# EAGLE design S3 IMU LED rev 1.1 (EAGLE 9.7.0)
Assembly variants: ESP32-S3 IMU, Analog LED Only
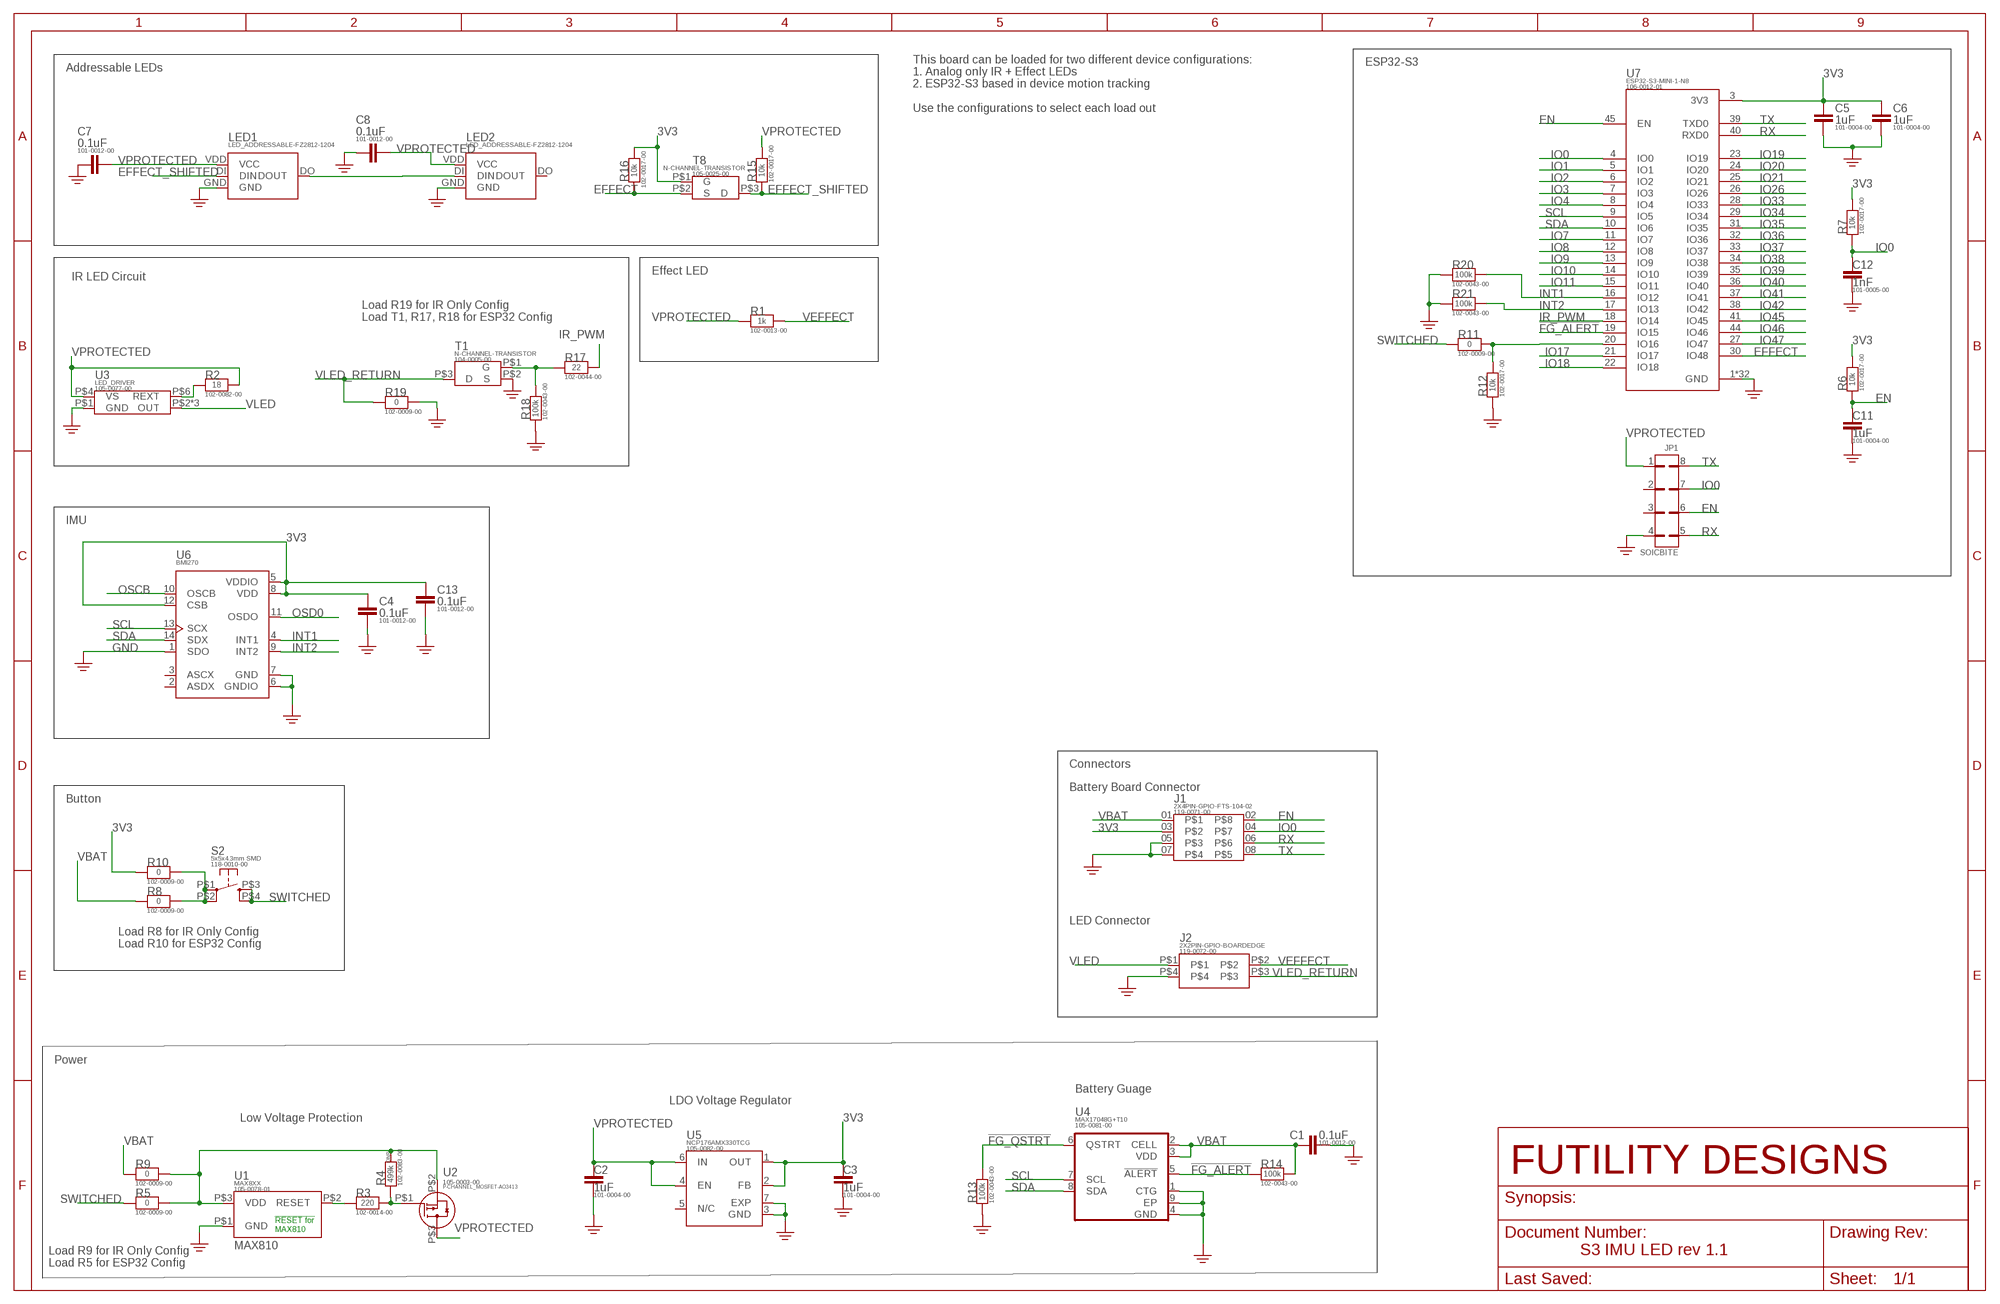
[diagram p0: schematic, sheet 1]

## Parts
C1  0.1uF  CAPACITOR-SMD-0402  [0402]  (not fitted in variant Analog LED Only)
C2  1uF  CAPACITOR-SMD-0402  [0402]  (not fitted in variant Analog LED Only)
C3  1uF  CAPACITOR-SMD-0402  [0402]  (not fitted in variant Analog LED Only)
C4  0.1uF  CAPACITOR-SMD-0402  [0402]  (not fitted in variant Analog LED Only)
C5  1uF  CAPACITOR-SMD-0402  [0402]  (not fitted in variant Analog LED Only)
C6  1uF  CAPACITOR-SMD-0402  [0402]  (not fitted in variant Analog LED Only)
C7  0.1uF  CAPACITOR-SMD-0402  [0402]  (not fitted in variant Analog LED Only)
C8  0.1uF  CAPACITOR-SMD-0402  [0402]  (not fitted in variant Analog LED Only)
C11  1uF  CAPACITOR-SMD-0402  [0402]  (not fitted in variant Analog LED Only)
C12  1nF  CAPACITOR-SMD-0402  [0402]  (not fitted in variant Analog LED Only)
C13  0.1uF  CAPACITOR-SMD-0402  [0402]  (not fitted in variant Analog LED Only)
J1  2X4PIN-GPIO-FTS-104-02  [SAMTEC_FTS-104-X-X-DV-X]
J2  2X2PIN-GPIO-BOARDEDGE  [LPPB022CFFN-BOARDEDGE]
JP1  SOICBITE  [SOICBITE]
LED1  LED_ADDRESSABLE-FZ2812-1204  [FZ2812-1204]  (not fitted in variant Analog LED Only)
LED2  LED_ADDRESSABLE-FZ2812-1204  [FZ2812-1204]  (not fitted in variant Analog LED Only)
R1  1k  RESISTOR-SMD0402  [0402]  (not fitted in variant ESP32-S3 IMU)
R2  18  RESISTOR-SMD0402  [0402]
R3  220  RESISTOR-SMD0402  [0402]
R4  499k  RESISTOR-SMD0402  [0402]
R5  0  RESISTOR-SMD0402  [0402]  (not fitted in variant Analog LED Only)
R6  10k  RESISTOR-SMD0402  [0402]  (not fitted in variant Analog LED Only)
R7  10k  RESISTOR-SMD0402  [0402]  (not fitted in variant Analog LED Only)
R8  0  RESISTOR-SMD0402  [0402]  (not fitted in variant ESP32-S3 IMU)
R9  0  RESISTOR-SMD0402  [0402]  (not fitted in variant ESP32-S3 IMU)
R10  0  RESISTOR-SMD0402  [0402]  (not fitted in variant Analog LED Only)
R11  0  RESISTOR-SMD0402  [0402]  (not fitted in variant Analog LED Only)
R12  10k  RESISTOR-SMD0402  [0402]  (not fitted in variant Analog LED Only)
R13  100k  RESISTOR-SMD0402  [0402]  (not fitted in variant Analog LED Only)
R14  100k  RESISTOR-SMD0402  [0402]  (not fitted in variant Analog LED Only)
R15  10k  RESISTOR-SMD0402  [0402]  (not fitted in variant Analog LED Only)
R16  10k  RESISTOR-SMD0402  [0402]  (not fitted in variant Analog LED Only)
R17  22  RESISTOR-SMD0402  [0402]  (not fitted in variant Analog LED Only)
R18  100k  RESISTOR-SMD0402  [0402]  (not fitted in variant Analog LED Only)
R19  0  RESISTOR-SMD0402  [0402]  (not fitted in variant ESP32-S3 IMU)
R20  100k  RESISTOR-SMD0402  [0402]  (not fitted in variant Analog LED Only)
R21  100k  RESISTOR-SMD0402  [0402]  (not fitted in variant Analog LED Only)
S2  5x5x4.3mm SMD  BUTTON_MOM-6X6X4.3SMD  [6X6X4.3_SMD]
T1  N-CHANNEL-TRANSISTOR  [SOT23]  (not fitted in variant Analog LED Only)
T8  N-CHANNEL-TRANSISTOR  [SOT23]  (not fitted in variant Analog LED Only)
U1  MAX8XX  [SOT23]
U2  P-CHANNEL_MOSFET-AO3413  [SOT23]
U3  LED_DRIVER  [SOT26]
U4  MAX17048G+T10  [SON50P200X200X80-9N]  (not fitted in variant Analog LED Only)
U5  NCP176AMX330TCG  [PSON40P120X120X45-7N_NCP176AMX330TCG]  (not fitted in variant Analog LED Only)
U6  BMI270  [XDCR_BMI270]  (not fitted in variant Analog LED Only)
U7  ESP32-S3-MINI-1-N8  [XCVR_ESP32-S3-MINI-1-N8]  (not fitted in variant Analog LED Only)

## Nets
3V3: C3.P$1 C4.P$1 C5.P$1 C6.P$1 C13.P$1 J1.03 R6.P$2 R7.P$2 R10.P$1 R16.P$2 T8.P$1(G) U5.1(OUT) U5.2(FB) U6.5(VDDIO) U6.8(VDD) U6.12(CSB) U7.3(3V3)
!FG_ALERT: R14.P$1 U4.5(!ALERT) U7.19(IO15)
!FG_QSTRT: R13.P$2 U4.6(QSTRT)
EFFECT: R16.P$1 T8.P$2(S) U7.30(IO48)
EFFECT_SHIFTED: LED1.DI(DIN) R15.P$1 T8.P$3(D)
EN: C11.P$1 J1.02 JP1.6 R6.P$1 U7.45(EN)
GND: C1.P$2 C2.P$2 C3.P$2 C4.P$2 C5.P$2 C6.P$2 C7.P$2 C8.P$2 C11.P$2 C12.P$2 C13.P$2 J1.05 J1.07 J2.P$4 JP1.4 LED1.GND LED2.GND R12.P$1 R13.P$1 R18.P$1 R19.P$2 R20.P$1 R21.P$1 T1.P$2(S) U1.P$1(GND) U3.P$1(GND) U4.1(CTG) U4.4(GND) U4.9(EP) U5.3(GND) U5.7(EXP) U6.1(SDO) U6.6(GNDIO) U6.7(GND) U7.1(GND) U7.2(GND) U7.42(GND) U7.43(GND) U7.46(GND) U7.47(GND) U7.48(GND) U7.49(GND) U7.50(GND) U7.51(GND) U7.52(GND) U7.53(GND) U7.54(GND) U7.55(GND) U7.56(GND) U7.57(GND) U7.58(GND) U7.59(GND) U7.60(GND) U7.61(GND) U7.61_1(GND) U7.61_2(GND) U7.61_3(GND) U7.61_4(GND) U7.61_5(GND) U7.61_6(GND) U7.61_7(GND) U7.61_8(GND) U7.62(GND) U7.63(GND) U7.64(GND) U7.65(GND)
INT1: R20.P$2 U6.4(INT1) U7.16(IO12)
INT2: R21.P$2 U6.9(INT2) U7.17(IO13)
IO0: C12.P$1 J1.04 JP1.7 R7.P$1 U7.4(IO0)
IO1: U7.5(IO1)
IO2: U7.6(IO2)
IO3: U7.7(IO3)
IO4: U7.8(IO4)
IO7: U7.11(IO7)
IO8: U7.12(IO8)
IO9: U7.13(IO9)
IO10: U7.14(IO10)
IO11: U7.15(IO11)
IO17: U7.21(IO17)
IO18: U7.22(IO18)
IO19: U7.23(IO19)
IO20: U7.24(IO20)
IO21: U7.25(IO21)
IO26: U7.26(IO26)
IO33: U7.28(IO33)
IO34: U7.29(IO34)
IO35: U7.31(IO35)
IO36: U7.32(IO36)
IO37: U7.33(IO37)
IO38: U7.34(IO38)
IO39: U7.35(IO39)
IO40: U7.36(IO40)
IO41: U7.37(IO41)
IO42: U7.38(IO42)
IO45: U7.41(IO45)
IO46: U7.44(IO46)
IO47: U7.27(IO47)
IR_PWM: R17.P$2 U7.18(IO14)
N$1: R4.P$2 R5.P$2 R9.P$2 U1.P$3(VDD) U2.P$2(S)
N$2: R2.P$1 U3.P$6(REXT)
N$3: R3.P$1 U1.P$2(RESET)
N$4: R3.P$2 R4.P$1 U2.P$1(G)
N$10: R8.P$2 R10.P$2 S2.P$1(P) S2.P$2(P1)
N$14: R17.P$1 R18.P$2 T1.P$1(G)
N$17: LED1.DO(DOUT) LED2.DI(DIN)
N$55: R11.P$2 R12.P$2 U7.20(IO16)
OSCB: U6.10(OSCB)
OSD0: U6.11(OSDO)
RX: J1.06 JP1.5 U7.40(RXD0)
SCL: U4.7(SCL) U6.13(SCX) U7.9(IO5)
SDA: U4.8(SDA) U6.14(SDX) U7.10(IO6)
SWITCHED: R5.P$1 R11.P$1 S2.P$3(S) S2.P$4(S1)
TX: J1.08 JP1.8 U7.39(TXD0)
VBAT: C1.P$1 J1.01 R8.P$1 R9.P$1 R14.P$2 U4.2(CELL) U4.3(VDD)
VEFFECT: J2.P$2 R1.P$2
VLED: J2.P$1 U3.P$2(OUT) U3.P$3(OUT) U3.P$5(OUT)
VLED_RETURN: J2.P$3 R19.P$1 T1.P$3(D)
VPROTECTED: C2.P$1 C7.P$1 C8.P$1 JP1.1 LED1.VDD(VCC) LED2.VDD(VCC) R1.P$1 R2.P$2 R15.P$2 U2.P$3(D) U3.P$4(VS) U5.4(EN) U5.6(IN)
Unconnected: JP1.2 JP1.3 LED2.DO(DOUT) U5.5(N/C) U6.2(ASDX) U6.3(ASCX)

## Notes on the sheet
- ESP32-S3
- Addressable LEDs
- This board can be loaded for two different device configurations:
  1. Analog only IR + Effect LEDs
  2. ESP32-S3 based in device motion tracking
  
  Use the configurations to select each load out
- Effect LED
- IR LED Circuit
- Load R19 for IR Only Config
  Load T1, R17, R18 for ESP32 Config
- IMU
- Connectors
- Battery Board Connector
- Button
- LED Connector
- Load R8 for IR Only Config
  Load R10 for ESP32 Config
- Power
- Battery Guage
- LDO Voltage Regulator
- Low Voltage Protection
- MAX810
- Load R9 for IR Only Config
  Load R5 for ESP32 Config

## Library data of the parts
C1 C4 C7 C8 C13 = 1-chris-parts:CAPACITOR-SMD; PART_NUMBER: 101-0012-00
C2 C3 C5 C6 C11 = 1-chris-parts:CAPACITOR-SMD; PART_NUMBER: 101-0004-00
C12 = 1-chris-parts:CAPACITOR-SMD; PART_NUMBER: 101-0005-00
J1 = 1-Chris-Connectors:2X4PIN-GPIO; PART_NUMBER: 119-0071-00
J2 = 1-Chris-Connectors:2X2PIN-GPIO; PART_NUMBER: 119-0072-00
JP1 = 1-chris-parts:SOICBITE: SOICbite footprint Allows for direct clipping of a SOIC-8 Testclip onto a PCB edge for Programming/Debugging purposes without extra components. Original footprint created by: Simon Merrit Adapted to Eagle by: Chiel Voswijk (Foxhood) NOTE: Footprint is to be used on the edge of a PCB and may require the use of thin traces for accessing the inner pads. This may violate some Design Rules! One can often ignore these, but understand working is NOT guaranteed.
LED1 LED2 = 1-chris-parts:LED_ADDRESSABLE; PART_NUMBER: 103-0018-00
R1 = 1-chris-parts:RESISTOR-SMD; PART_NUMBER: 102-0013-00
R2 = 1-chris-parts:RESISTOR-SMD; PART_NUMBER: 102-0082-00
R3 = 1-chris-parts:RESISTOR-SMD; PART_NUMBER: 102-0014-00
R4 = 1-chris-parts:RESISTOR-SMD; DNP: yes; PART_NUMBER: 102-0083-00
R5 R8-R11 R19 = 1-chris-parts:RESISTOR-SMD; PART_NUMBER: 102-0009-00
R6 R7 R12 R15 R16 = 1-chris-parts:RESISTOR-SMD; PART_NUMBER: 102-0017-00
R13 R14 R18 R20 R21 = 1-chris-parts:RESISTOR-SMD; PART_NUMBER: 102-0043-00
R17 = 1-chris-parts:RESISTOR-SMD; PART_NUMBER: 102-0044-00
S2 = 1-chris-parts:BUTTON_MOM: OMRON SWITCH; PART_NUMBER: 118-0010-00
T1 = 1-chris-parts:N-CHANNEL-TRANSISTOR; PART_NUMBER: 104-0005-00
T8 = 1-chris-parts:N-CHANNEL-TRANSISTOR; PART_NUMBER: 105-0025-00
U1 = 1-chris-parts:MAX8XX; PART_NUMBER: 105-0078-01
U2 = 1-chris-parts:P-CHANNEL_MOSFET; PART_NUMBER: 105-0003-00
U3 = 1-chris-parts:LED_DRIVER; PART_NUMBER: 105-0077-00
U4 = 1-chris-parts:MAX17048G+T10; PART_NUMBER: 105-0081-00
U5 = 1-chris-parts:NCP176AMX330TCG; PART_NUMBER: 105-0082-00
U6 = 1-chris-parts:BMI270; MANUFACTURER: Bosch Sensortec; PART_NUMBER: 109-0015-00
U7 = 1-Chris-ESP:ESP32-S3-MINI-1-N8; MANUFACTURER: Espressif; PART_NUMBER: 106-0012-01

## Net classes
1 diff pairs: width 0.152 mm

## Board
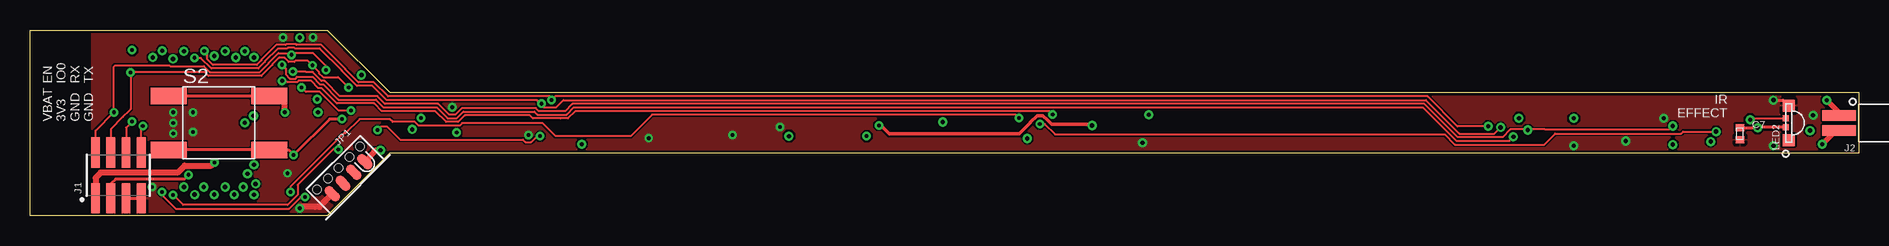
[diagram p1: board, top side]
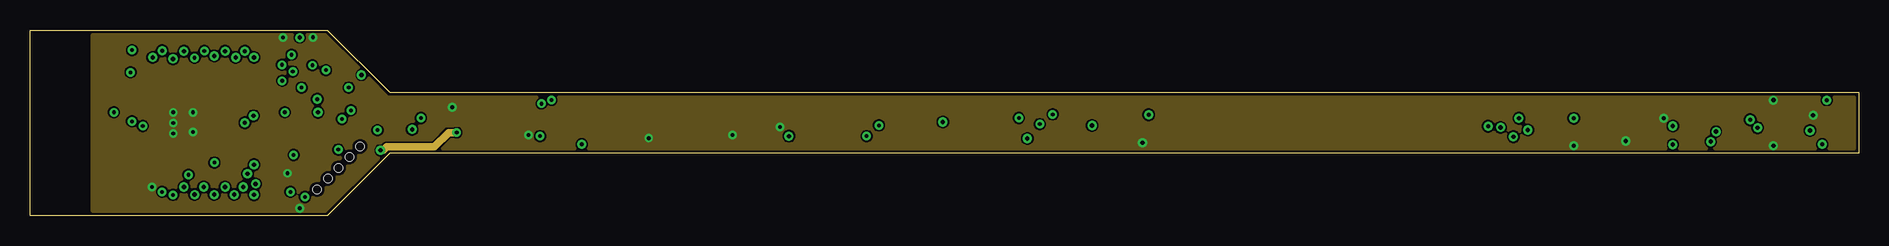
[diagram p2: board, inner layer Route2]
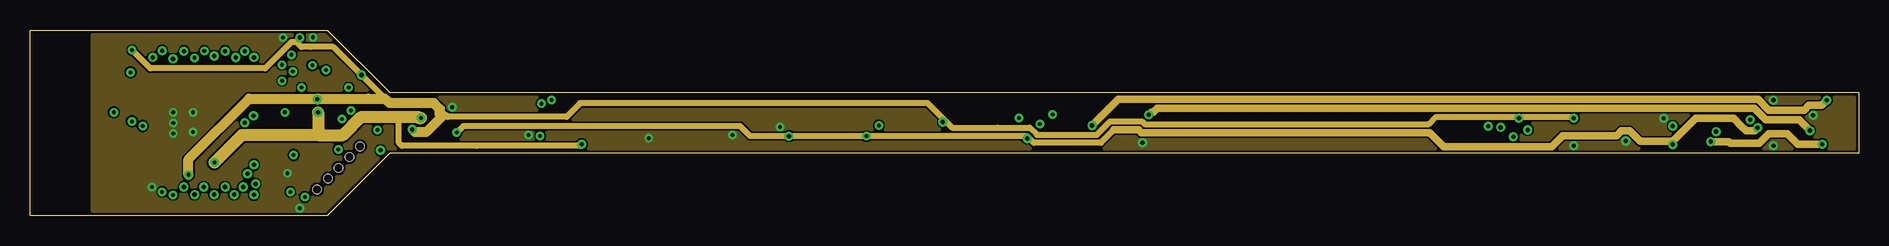
[diagram p3: board, inner layer Route63]
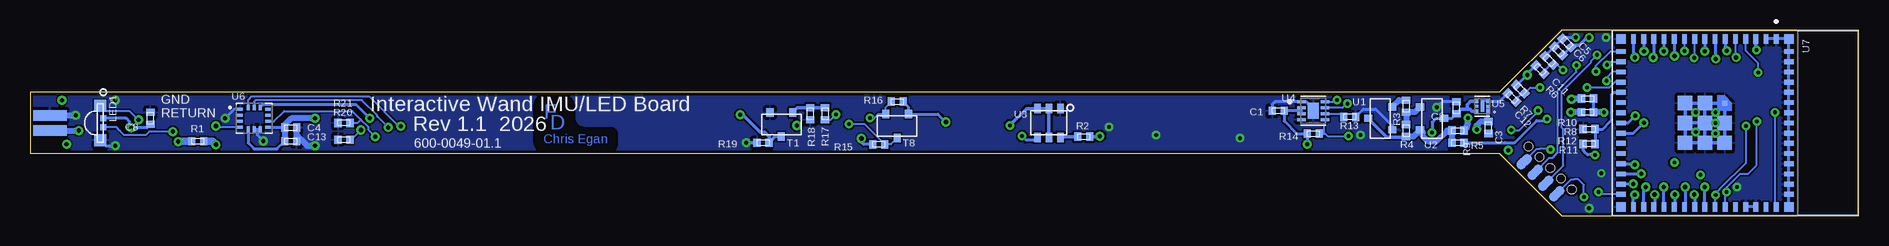
[diagram p4: board, bottom side, seen from below]

Size 152.4 x 15.49 mm. Coordinates in mm from the lower left corner, seen from the top.
Outline: 29.97,5.21 24.77,0 0,0 0,15.49 24.77,15.49 29.97,10.29 152.4,10.29 152.4,5.21 29.97,5.21
Copper layers (1+2*15+16): Top / Route2 / Route63 / Bottom
Stack-up 4 Layer Stack: Top SilkScreen Epoxy Ink / Top SolderMask SR:Green 0.0254mm Dk 4.3 / Top Surface Finish Lead-Free 0.02mm / Top CuFoil:007 0.035mm / Dielectric-1 Prepreg:001 0.064mm / Dielectric-2 Prepreg:001 0.064mm / Route2 CuFoil:007 0.035mm / Dielectric-3 User Defined 0.52mm / Route63 CuFoil:007 0.035mm / Dielectric-4 Prepreg:001 0.064mm / Dielectric-5 Prepreg:001 0.064mm / Bottom CuFoil:007 0.035mm / Bottom Surface Finish Lead-Free 0.02mm / Bottom SolderMask SR:Green 0.0254mm Dk 4.3 / Bottom SilkScreen Epoxy Ink
Design rules: minimum copper width classes=1 6mil, minimum copper width 6mil, minimum drill size 0.3mm, copper clearance wire_polygon to wire_polygon 6mil, copper clearance wire_polygon to pad_smd 6mil, copper clearance wire_polygon to via 6mil, copper clearance pad_smd to pad_smd 6mil, copper clearance pad_smd to via 6mil, copper clearance via to via 6mil, copper clearance smd to pad (same net) 6mil, copper clearance smd to via (same net) 6mil, copper clearance smd to smd (same net) 6mil, dimension clearance 10mil, via restrict clearance 0mil, restrict clearance 0mil, drill distance 6mil, keepout clearance 0mil

### Footprints (pad centres in the part's own frame; a part is rotated, then mirrored left to right if it is on the bottom)
0402 = smd 0.7 x 0.6: P$1 0,0.5; P$2 0,-0.5
SAMTEC_FTS-104-X-X-DV-X = smd 0.737 x 2.54: 01 -1.905,-1.905; 02 -1.905,1.905; 03 -0.635,-1.905; 04 -0.635,1.905; 05 0.635,-1.905; 06 0.635,1.905; 07 1.905,-1.905; 08 1.905,1.905
LPPB022CFFN-BOARDEDGE = smd 2.794 x 0.889: P$1 1.651,-0.635; P$2 1.651,0.635 | smd 2.794 x 0.889 bottom: P$3 1.651,0.635; P$4 1.651,-0.635
SOICBITE = smd 0.8 x 1.5: 1 1.905,0.75; 2 0.635,0.75; 3 -0.635,0.75; 4 -1.905,0.75 | smd 0.8 x 1.5 bottom: 5 -1.905,0.75; 6 -0.635,0.75; 7 0.635,0.75; 8 1.905,0.75 | hole 0.7: -2.54,1.905; -1.27,1.905; 0,1.905; 1.27,1.905; 2.54,1.905
FZ2812-1204 = smd 0.5 x 0.5: DI 0.375,0.25; VDD -0.375,0.25 | smd 1 x 1: DO -1.425,0; GND 1.425,0
6X6X4.3_SMD = smd 3 x 1.4: P$1 -4.2,2.25; P$2 4.2,2.25; P$3 -4.2,-2.25; P$4 4.2,-2.25
SOT23 = smd 0.6 x 0.7: P$1 -0.95,-1; P$2 0.95,-1; P$3 0,1
SOT26 = smd 0.55 x 0.8: P$1 -0.95,-1.2; P$2 0,-1.2; P$3 0.95,-1.2; P$4 0.95,1.2; P$5 0,1.2; P$6 -0.95,1.2
SON50P200X200X80-9N = smd 0.76 x 0.27: 1 -0.985,0.75; 2 -0.985,0.25; 3 -0.985,-0.25; 4 -0.985,-0.75; 5 0.985,-0.75; 6 0.985,-0.25; 7 0.985,0.25; 8 0.985,0.75 | smd 0.9 x 1.3: 9 0,0
PSON40P120X120X45-7N_NCP176AMX330TCG = smd 0.31 x 0.25: 1 -0.455,0.4; 2 -0.455,0; 3 -0.455,-0.4; 4 0.455,-0.4; 5 0.455,0; 6 0.455,0.4 | smd 0.3 x 0.94: 7 0,0
XDCR_BMI270 = smd 0.475 x 0.25: 1 -1.163,0.75; 2 -1.163,0.25; 3 -1.163,-0.25; 4 -1.163,-0.75; 8 1.163,-0.75; 9 1.163,-0.25; 10 1.163,0.25; 11 1.163,0.75 | smd 0.25 x 0.475: 5 -0.5,-0.912; 6 0,-0.912; 7 0.5,-0.912; 12 0.5,0.912; 13 0,0.912; 14 -0.5,0.912
XCVR_ESP32-S3-MINI-1-N8 = smd 0.8 x 0.4: 1 -7,5.95; 2 -7,5.1; 3 -7,4.25; 4 -7,3.4; 5 -7,2.55; 6 -7,1.7; 7 -7,0.85; 8 -7,0; 9 -7,-0.85; 10 -7,-1.7; 11 -7,-2.55; 12 -7,-3.4; 13 -7,-4.25; 14 -7,-5.1; 15 -7,-5.95; 31 7,-5.95; 32 7,-5.1; 33 7,-4.25; 34 7,-3.4; 35 7,-2.55; 36 7,-1.7; 37 7,-0.85; 38 7,0; 39 7,0.85; 40 7,1.7; 41 7,2.55; 42 7,3.4; 43 7,4.25; 44 7,5.1; 45 7,5.95 | smd 0.4 x 0.8: 16 -5.95,-7; 17 -5.1,-7; 18 -4.25,-7; 19 -3.4,-7; 20 -2.55,-7; 21 -1.7,-7; 22 -0.85,-7; 23 0,-7; 24 0.85,-7; 25 1.7,-7; 26 2.55,-7; 27 3.4,-7; 28 4.25,-7; 29 5.1,-7; 30 5.95,-7; 46 5.95,7; 47 5.1,7; 48 4.25,7; 49 3.4,7; 50 2.55,7; 51 1.7,7; 52 0.85,7; 53 0,7; 54 -0.85,7; 55 -1.7,7; 56 -2.55,7; 57 -3.4,7; 58 -4.25,7; 59 -5.1,7; 60 -5.95,7 | smd 1.2 x 1.2: 61 0,0; 61_2 0,1.65; 61_3 1.65,1.65; 61_4 1.65,0; 61_5 1.65,-1.65; 61_6 0,-1.65; 61_7 -1.65,-1.65; 61_8 -1.65,0 | smd 0.4 x 0.4: 61_1 -1.65,1.65 | smd 0.8 x 0.8: 62 -7,7; 63 -7,-7; 64 7,-7; 65 7,7

### Placement (x,y rotation side)
C1  48.39,8.76 270 bottom
C2  33.53,9.02 180 bottom
C3  30.86,7.37 0 bottom
C4  130.68,7.37 90 bottom
C5  24.34,14.43 225 bottom
C6  25.04,13.73 225 bottom
C7  142.49,6.86 0 top
C8  142.37,8.13 180 bottom
C11  25.8,12.97 225 bottom
C12  28.91,9.86 225 bottom
C13  130.68,6.22 90 bottom
J1  7.37,3.38 0 top
J2  152.4,7.75 180 top
JP1  27.06,2.66 45 top
LED1  146.56,7.75 270 bottom
LED2  146.56,7.75 90 top
R1  138.43,6.22 270 bottom  (not fitted)
R2  64.59,6.6 90 bottom
R3  37.72,9.14 0 bottom
R4  37.72,7.11 0 bottom
R5  33.4,6.1 270 bottom
R6  26.56,12.21 225 bottom
R7  28.21,10.56 225 bottom
R8  22.61,8.64 90 bottom  (not fitted)
R9  33.4,7.11 270 bottom  (not fitted)
R10  22.61,9.78 90 bottom
R11  22.48,6.01 90 bottom
R12  22.48,7.24 90 bottom
R13  42.42,8.25 270 bottom
R14  45.47,6.86 270 bottom
R15  81.66,5.97 270 bottom
R16  80.14,9.53 90 bottom
R17  86.14,8.51 0 bottom
R18  87.38,8.51 180 bottom
R19  91.31,6.1 270 bottom  (not fitted)
R20  126.24,6.35 90 bottom
R21  126.24,7.75 90 bottom
S2  15.75,7.75 0 top
T1  89.79,7.62 180 bottom
T8  80.14,7.49 180 bottom
U1  39.88,8.13 90 bottom
U2  35.56,8.13 270 bottom
U3  67.49,7.75 180 bottom
U4  45.47,8.76 0 bottom
U5  31.37,9.14 180 bottom
U6  133.73,8.13 0 bottom
U7  12.83,7.75 270 bottom
U$1  [LOGO_SMALLER]  109.6,6.05 0 bottom

### Tracks (layer width: path | path; a pad name or v marks a point on that pad's centre or on a via)
3V3  (via drill 0.3, 0.35)
  Top 0.254: v13.21,3.43 12.85,3.07 7.19,3.07 7.14,3.07 6.73,2.67 J1.03
  Route63 0.305: v22.48,14.86 22.48,14.73 22.23,14.48
  Route63 0.508: 76.07,8.13 76.33,7.87 76.84,7.37 80.65,7.37 83.31,7.37 83.93,6.75 88.89,6.75 90.01,7.87 92.67,7.87 92.89,7.65 116.55,7.65 117.15,8.25 124.08,8.25 | 76.07,8.13 74.8,9.4 45.85,9.4 44.71,8.26 34.85,8.26 34.73,8.38 34.42,8.38 34.16,8.38 | 32.06,6.98 v31.84,7.21 | v76.07,7.83 76.07,8.13 | 29.97,9.4 v27.62,11.75 25.27,14.1 23.37,14.1 22.61,14.1 22.23,14.48 21.78,14.48 19.59,12.3 10.03,12.3 v8.51,13.81 | v128.65,8.13 128.52,8.25 126.62,8.25 124.08,8.25 | v124.08,8.13 124.08,8.25
  Route63 0.813: 34.42,8.38 33.02,6.98 32.06,6.98 | 34.16,8.38 34.16,8.89 33.66,9.4 30.73,9.4 29.97,9.4 29.74,9.63 29.7,9.63 29.55,9.78 28.19,9.78 24,9.78 | 24,9.78 v23.94,9.71 | v13.21,3.43 13.21,4.72 18.27,9.78 24,9.78
  Bottom 0.254: R16.P$2 79.19,9.07 T8.P$1 76.74,8.49 v76.07,7.83 | R6.P$2 27.62,11.86 v27.62,11.75 28.45,10.91 R7.P$2 | R7.P$2 | U5.2 U5.1 | C6.P$1 C5.P$1 | U6.8 131.19,7.38 C4.P$1 | U6.5 134.23,6.09 133.73,5.59 131.82,5.59 C13.P$1 | U6.12 132.97,9.3 131.57,9.3 125.25,9.3 v124.08,8.13
  Bottom 0.305: U7.3 8.58,13.88 v8.51,13.81 | C5.P$1 23.98,14.21 C5.P$1 | U5.1 30.91,7.92 C3.P$1 | C5.P$1 23.83,14.23 23.31,14.23 22.68,14.86 v22.48,14.86
  Bottom 0.508: v31.84,7.21 31.84,7.53 31.5,7.87 C3.P$1 | R10.P$1 23.88,9.78 v23.94,9.71 | C13.P$1 C4.P$1 131.18,7.59 130.65,8.13 v128.65,8.13
!FG_ALERT  (via drill 0.3)
  Top 0.152: v28.96,7.15 29.28,7.47 29.74,7.47 30.85,6.36 41.08,6.36 41.29,6.15 41.77,6.15 42.27,6.65 v42.51,6.65 | v26.74,8.8 26.72,8.78 25.74,8.78 24.17,10.35 22.98,10.35 v22.64,10.69
  Bottom 0.152: R14.P$1 44.47,6.86 | 44.47,6.86 44.26,6.65 v42.51,6.65 | U7.19 19.86,11.18 20.28,11.18 20.78,10.68 22.63,10.68 v22.64,10.69 | U4.5 44.48,7.69 44.57,7.6 44.57,6.96 44.47,6.86 | v28.96,7.15 28.28,7.15 26.74,8.69 v26.74,8.8
!FG_QSTRT
  Bottom 0.152: U4.6 43.18,8.51 R13.P$2
EFFECT  (via drill 0.3)
  Top 0.152: v21.69,2.01 21.69,2.44 26.14,6.88 26.26,6.88 27.46,8.08 30,8.08 30.23,7.85 32.06,7.85 32.38,7.52 35.81,7.52 36.01,7.73 42.73,7.73 43.8,6.65 50.06,6.65 51.84,8.43 82.12,8.43 v82.4,8.16
  Bottom 0.152: U7.30 21.48,1.8 v21.69,2.01 | R16.P$1 81.09,9.07 T8.P$2 81.1,8.51 81.69,8.51 82.05,8.16 v82.4,8.16
EFFECT_SHIFTED  (via drill 0.3, 0.35)
  Top 0.152: v84.15,7.65 84.56,7.65 85.43,6.79 117.9,6.79 118.74,5.95 126.19,5.95 127.09,6.85 137.59,6.85 137.76,7.03 v140.51,7.03
  Bottom 0.152: T8.P$3 80.66,5.97 R15.P$1 82.84,7.65 v84.15,7.65 | LED1.DI 145.17,7.37 144.91,7.11 144.53,6.73 142.76,6.73 142.46,7.03 v140.51,7.03
EN  (via drill 0.3)
  Top 0.152: J1.02 5.46,7.11 v6.98,8.64 6.98,12.45 7.09,12.55 11.59,12.55 11.67,12.47 14.49,12.47 14.98,11.98 19.17,11.98 19.89,12.7 19.89,12.75 20.69,13.56 21.85,13.56 | 21.85,13.56 21.85,13.54 21.8,13.49 v21.8,13.43 | 21.85,13.56 23.6,13.56 24.66,12.5 v24.66,12.15
  Bottom 0.152: v6.98,8.64 6.98,0.85 U7.45 | 25.55,12.73 C11.P$1 25.55,12.73 | 25.9,12.38 25.94,12.35 26.21,12.08 R6.P$1 | 25.9,12.38 25.4,12.89 v24.66,12.15 | 25.9,12.38 25.55,12.73 | v21.8,13.43 22.31,12.92 22.31,12.79 24.35,10.75 24.77,10.33 24.77,7.37 24.63,7.23 24.63,4.19 JP1.6
GND  (via drill 0.3, 0.35)
  Top 0.254: LED2.GND 146.07,9.65 v145.29,9.65 | J1.05 J1.07
  Top 0.508: JP1.4 24.11,0.76 23.75,0.76 22.61,0.76 v22.48,0.63
  Bottom 0.254: U7.65 U7.46 U7.47 U7.48 U7.49 U7.50 U7.51 U7.52 U7.53 U7.54 U7.55 U7.56 U7.57 U7.58 U7.59 U7.60 U7.62 U7.1 U7.2 | U7.43 U7.42 | U4.9 45.79,9.09 45.79,9.24 46.06,9.51 U4.1 48.65,9.51 48.77,9.4 48.89,9.28 C1.P$2 | R13.P$1 41.28,8.89 40.77,8.89 40.26,8.89 39.62,8.25 38.88,7.51 U1.P$1 | 24.64,14.86 24.69,14.91 | 24.69,14.91 C5.P$2 | 24.69,14.91 C5.P$2 | C5.P$2 C6.P$2 C11.P$2 | C5.P$2 24.58,14.89 v23.59,14.89 | 31.02,9.65 U5.3 29.93,9.54 C12.P$2 | C2.P$2 34.71,9.52 v35.18,9.04 | LED1.GND 146.07,5.84 v145.29,5.84 | U6.6 133.48,7.22 | 133.48,7.22 U6.7 | 133.48,7.22 133.48,6.75 v132.97,6.25 | U6.1 135.4,8.88 v136.14,8.13
  Bottom 0.305: U7.61_2 U7.61_3 U7.61_4 | U7.61_2 U7.61_1 U7.61_8 | U7.61_8 U7.61_7 U7.61_6 | U7.61_6 U7.61_5 U7.61_4 | U7.61_4 U7.61 | U7.61 v11.94,7.75 U7.61_2 | U7.61 U7.61_8 | U7.61 U7.61_6 | R19.P$2 v92.71,6.1 | U5.7 31.37,9.65 31.02,9.65
  Bottom 0.508: C13.P$2 130.18,6.73 | 130.18,6.73 C4.P$2 | 130.18,6.73 129.29,5.84 v128.65,5.84 | J2.P$4 v148.59,8.38
  other vias: 62.48,7.41 58.55,6.73 21.08,14.86 11.94,8.64 11.94,6.86 21.46,3.56 41.53,6.73 51.56,6.48 13.59,8.64 13.59,6.98 10.16,2.41
  pour Top: -69.29,19.43 155.75,19.43 155.75,-3.56 -69.29,-3.56
  pour Bottom: -69.67,19.81 -69.67,-5.21 156.64,-5.21 156.64,20.14
  pour Route2: -1.4,17.53 -1.4,-2.29 154.56,-2.29 154.56,17.27
  pour Route63: -1.91,18.03 155.19,18.03 155.19,-2.54 -1.65,-2.54 -1.65,-2.29
INT1  (via drill 0.3, 0.35)
  Top 0.152: v21.9,12.03 21.92,12.01 22.98,12.01 23.02,11.97 23.58,11.97 24.29,11.26 24.54,11.26 25.81,9.99 28.94,9.99 29.58,9.35 34.02,9.35 34.93,8.44 35.43,8.44 35.98,8.99 42.15,8.99 42.4,8.74 44.58,8.74 45.19,9.35 116.21,9.35 119,6.56 122.72,6.56 123.37,7.21 124.84,7.21 | v136.91,7.49 136.62,7.21 126.24,7.21 124.84,7.21 | v124.82,7.16 124.84,7.18 124.84,7.21
  Bottom 0.152: U7.16 20.71,13.7 21.94,12.46 21.94,12.07 v21.9,12.03 | U6.4 136.79,7.38 v136.91,7.49 | R20.P$2 125.63,6.35 v124.82,7.16
INT2  (via drill 0.3, 0.35)
  Top 0.152: v20.99,12.6 21.32,12.27 21.32,11.79 21.66,11.45 22.14,11.45 22.27,11.58 23.54,11.58 24.16,10.96 24.42,10.96 25.69,9.69 28.81,9.69 29.46,9.04 33.89,9.04 34.8,8.13 35.56,8.13 36.11,8.69 42.02,8.69 42.27,8.44 44.71,8.44 45.31,9.04 89.15,9.04 | 89.15,9.04 89.28,9.04 | v123.62,6.6 123.27,6.25 118.87,6.25 116.08,9.04 89.15,9.04
  Bottom 0.152: U7.17 20.88,12.85 20.99,12.75 v20.99,12.6 | U6.9 132.08,7.88 131.22,8.73 125.54,8.73 124.82,8.02 | R21.P$2 125.09,7.75 124.82,8.02 | v123.62,6.6 124.22,7.2 124.22,7.41 124.82,8.02
IO0  (via drill 0.3)
  Top 0.152: J1.04 6.73,7.24 7.75,8.25 8.25,8.76 8.38,8.89 v8.38,11.97 14.57,11.97 14.86,11.68 19.29,11.68 20.19,12.58 20.19,12.62 20.75,13.18 21.23,13.18 21.56,12.85 22.04,12.85 22.14,12.95 23.13,12.95 v23.53,12.56 24.08,12 24.08,11.91 24.42,11.57 25.69,11.57 v26.56,10.69
  Bottom 0.152: U7.4 9.43,13.78 8.38,12.73 v8.38,11.97 | 25.4,4.96 25.53,4.83 25.78,4.83 JP1.7 | 25.4,4.96 25.39,4.97 | v23.53,12.56 23.53,12 25.07,10.46 25.07,5.29 25.4,4.96 | 27.97,10.31 R7.P$1 | R7.P$1 27.97,10.31 | 27.97,10.31 28.56,9.73 C12.P$1 | R7.P$1 27.37,10.69 v26.56,10.69
IO1  (via drill 0.35)
  Bottom 0.152: U7.5 10.28,13.26 v10.23,13.21
IO2  (via drill 0.35)
  Bottom 0.254: U7.6 11.13,13.88 v11.01,13.76
IO3  (via drill 0.35)
  Bottom 0.254: U7.7 11.98,13.14 v11.92,13.08
IO4  (via drill 0.35)
  Bottom 0.254: U7.8 v12.83,13.72
IO7  (via drill 0.35)
  Bottom 0.254: U7.11 15.38,13.34 v15.36,13.33
IO8  (via drill 0.35)
  Bottom 0.254: U7.12 16.26,14.72 v16.26,13.72
IO9  (via drill 0.35)
  Bottom 0.254: U7.13 17.08,13.28 17.14,13.22 v17.14,13.2
IO10  (via drill 0.35)
  Bottom 0.254: U7.14 17.93,13.75 v17.9,13.72
IO11  (via drill 0.35)
  Bottom 0.254: U7.15 18.78,13.32 v18.67,13.21
IO19  (via drill 0.35)
  Bottom 0.254: U7.23 19.22,7.75 v18.62,8.34
IO20  (via drill 0.35)
  Bottom 0.254: U7.24 18.78,6.9 v17.91,7.77
IO33  (via drill 0.35)
  Bottom 0.254: U7.28 18.22,3.5 18.19,3.52 v18.13,3.52
IO34  (via drill 0.35)
  Bottom 0.254: U7.29 19.81,2.67 v18.8,2.67
IO35  (via drill 0.35)
  Bottom 0.254: U7.31 18.78,1.65 v18.67,1.76
IO36  (via drill 0.35)
  Bottom 0.254: U7.32 17.93,2.25 v17.76,2.41
IO37  (via drill 0.35)
  Bottom 0.254: v17.02,1.78 17.02,0.81 U7.33
IO38  (via drill 0.35)
  Bottom 0.254: U7.34 16.26,0.78 v16.26,2.41
IO39  (via drill 0.35)
  Bottom 0.254: v15.34,1.78 15.34,0.78 U7.35
IO40  (via drill 0.35)
  Bottom 0.254: v14.48,2.41 14.48,0.8 U7.36
IO41  (via drill 0.35)
  Bottom 0.254: v13.72,1.78 13.67,1.73 13.67,0.76 U7.37
IO42  (via drill 0.35)
  Bottom 0.254: U7.38 v12.83,2.41
IO47  (via drill 0.35)
  Bottom 0.254: U7.27 18.75,4.35 v18.67,4.27
IR_PWM  (via drill 0.3)
  Top 0.152: v85.23,8.46 84.95,8.74 83.76,8.74 82.93,8.74 77.09,8.74 76.71,8.74 75.95,8.74 74.55,8.74 72.77,8.74 71.25,8.74 70.36,8.74 69.72,8.74 69.47,8.74 66.42,8.74 57.53,8.74 51.69,8.74 45.59,8.74 45.44,8.74 44.83,8.13 44.2,8.13 41.91,8.13 41.66,8.38 36.24,8.38 35.68,7.83 34.67,7.83 33.77,8.74 29.33,8.74 28.69,9.38 25.56,9.38 24.29,10.65 24.04,10.65 23.42,11.27 22.39,11.27 22.27,11.14 21.42,11.14 21.3,11.26 v21.02,11.26
  Bottom 0.152: R17.P$2 85.68,8.01 v85.23,8.46 | U7.18 20.54,12 21.02,11.52 v21.02,11.26
N$1
  Bottom 0.305: R4.P$2 37.76,6.57 39.35,6.57 40.88,8.1 U1.P$3
  Bottom 0.508: R5.P$2 R9.P$2 34.32,7.11 35.25,6.18 35.88,6.18 36.32,6.63 36.32,6.94 U2.P$2 37.13,6.61 R4.P$2
N$2
  Bottom 0.305: U3.P$6 66.48,6.6 R2.P$1
N$3
  Bottom 0.508: R3.P$1 38.31,9.64 U1.P$2
N$4
  Bottom 0.508: R4.P$1 R3.P$2 36.99,8.64 U2.P$1
N$10  (via drill 0.3)
  Top 0.254: v21.23,8.64 21.21,8.66 | 21.21,9.65 20.86,10 S2.P$2 S2.P$1
  Top 0.508: 21.21,8.66 21.21,9.65
  Bottom 0.254: R8.P$2 R10.P$2
  Bottom 0.508: v21.23,8.64 R8.P$2
N$14
  Bottom 0.305: R17.P$1 R18.P$2 88.45,9.01 T1.P$1
N$17  (via drill 0.35)
  Top 0.152: LED2.DI 143.63,8.12 143.53,8.02 v143.35,8.02
  Bottom 0.152: LED1.DO 146.15,8.76 144.15,8.76 143.4,8.02 v143.35,8.02
N$55
  Bottom 0.254: U7.20 20.44,10.3 20.45,10.29 20.57,10.16 20.57,8.76 20.57,8 20.7,7.87 21.34,7.24 R12.P$2 R11.P$2
RX  (via drill 0.3)
  Top 0.152: J1.06 8,7.37 8.5,7.87 v8.5,7.88 | v11.01,2.01 11.01,1.74 12.14,0.61 21.59,0.61 22.55,1.58 v22.91,1.58
  Bottom 0.152: v8.5,7.88 v8.51,7.87 8.51,4.22 9.23,3.5 9.89,3.5 11.01,2.38 11.01,1.88 | U7.40 11.13,1.63 11.01,1.74 11.01,1.88 | 11.01,1.88 v11.01,2.01 | v22.91,1.58 22.91,2.59 23.37,3.05 23.72,3.05 23.98,3.05 JP1.5
SCL  (via drill 0.3, 0.35)
  Top 0.152: 42.55,9.35 42.24,9.65 29.71,9.65 28.53,10.83 27.24,10.83 25.98,12.09 25.98,12.12 24.16,13.95 22.1,13.95 22.04,14.01 21.49,14.01 21.42,13.94 20.65,13.94 19.58,12.88 19.58,12.83 19.04,12.29 15.11,12.29 14.24,13.16 13.74,13.16 v13.72,13.18 | 42.55,9.35 42.85,9.05 43.85,9.05 44.45,9.65 116.33,9.65 119.12,6.86 122.04,6.86 v122.55,7.37 | 42.55,9.35 v42.61,9.35
  Bottom 0.152: U7.9 13.72,14.71 v13.72,13.18 | U4.7 43.03,9.01 42.69,9.35 v42.61,9.35 | U6.13 133.73,9.53 133.6,9.65 124.74,9.65 123.47,8.38 123.47,8.29 v122.55,7.37
SDA  (via drill 0.3, 0.35)
  Top 0.152: v121.51,7.47 118.94,7.47 116.46,9.96 43.78,9.96 v43.47,9.65 43.37,9.76 43.37,9.9 43.31,9.96 29.84,9.96 28.65,11.14 27.37,11.14 26.29,12.22 26.29,12.25 24.28,14.25 22.23,14.25 22.17,14.31 21.36,14.31 21.29,14.25 20.52,14.25 19.28,13 19.28,12.96 18.91,12.59 15.23,12.59 14.75,13.08 14.75,13.51 v14.52,13.74
  Bottom 0.152: U4.8 43.61,9.51 v43.47,9.65 | U6.14 134.23,9.66 133.93,9.96 124.15,9.96 121.66,7.47 v121.51,7.47 | U7.10 v14.53,13.75 v14.52,13.74
SWITCHED  (via drill 0.3)
  Top 0.254: S2.P$3 S2.P$4 21.55,5.5 v21.97,5.08 24.97,8.08 v25.99,8.08
  Bottom 0.254: v25.99,8.08 26.12,7.95 26.85,7.95 28.68,6.12 29.48,6.12 29.5,6.1 R5.P$1 | v21.97,5.08 22.61,5.08 22.86,5.33 22.98,5.45 R11.P$1
TX  (via drill 0.3)
  Top 0.152: J1.08 9.27,7.37 v9.4,7.49 | v25.69,5.53 25.66,5.56 25.27,5.56 22.3,2.58 22.3,1.76 21.46,0.92 12.76,0.92 v11.92,1.75
  Bottom 0.152: U7.39 11.98,1.85 11.92,1.91 | v25.69,5.53 25.75,5.59 26.57,5.59 26.82,5.59 JP1.8 | 11.92,1.91 v11.92,1.75 | 11.92,1.91 11.59,2.23 11.59,2.25 9.4,4.45 v9.4,7.49
VBAT  (via drill 0.3, 0.35)
  Top 0.508: v15.37,4.45 15.11,4.19 12.89,4.19 12.31,3.61 6.27,3.61 5.89,3.61 5.46,3.17 J1.01
  Route63 0.508: v45.97,5.97 45.85,5.84 37.21,5.84 30.99,5.84 30.73,6.1 30.73,8.24
  Route63 1.016: v32.58,8.16 32.43,8.16 32.34,8.24 30.73,8.24 27.62,8.24 26.1,6.73 24,6.73 | v24,8.64 24,6.73 | 24,6.73 18.49,6.73 17.65,6.73 v15.37,4.45
  Bottom 0.254: U4.3 46.45,8.76 | 46.45,8.76 U4.2 | 46.45,8.76 48,8.76 C1.P$1 47.89,7.92 46.82,6.86 R14.P$2 v45.97,5.97
  Bottom 0.508: R9.P$1 32.66,7.35 32.66,7.56 32.58,7.65 v32.58,8.16 | R8.P$1 v24,8.64
VEFFECT  (via drill 0.35)
  Top 0.406: J2.P$2 150.5,7.11 v149.35,5.97
  Route63 0.61: v149.35,5.97 147.32,5.97 146.81,6.48 146.43,6.86 145.29,6.86 144.91,6.86 144.12,6.07 141.68,6.07 141.56,6.19 140.16,6.19 140.16,6.2 v140.05,6.2
  Bottom 0.61: R1.P$2 140.03,6.22 v140.05,6.2
VLED  (via drill 0.3, 0.35)
  Top 0.305: v70.74,7.55 70.89,7.55 71.59,6.84 82.45,6.84 83.37,7.76 83.37,7.8 83.92,8.36 84.4,8.36 84.8,7.96 85.14,7.62 88.42,7.62 v88.51,7.54
  Top 0.406: J2.P$1 150.75,8.64 v149.73,9.65
  Route63 0.61: v149.73,9.65 149.3,9.22 148.24,9.22 147.85,8.82 144.91,8.82 144,9.73 90.7,9.73 v88.51,7.54
  Bottom 0.305: U3.P$5 U3.P$2 U3.P$3 69.34,8.95 v70.74,7.55
VLED_RETURN  (via drill 0.35)
  Route63 0.61: v148.34,7.11 147.45,8 146.05,8 144.65,8 143.69,8.97 93.93,8.97 93.62,8.66 93.44,8.66 v93.22,8.44
  Bottom 0.305: T1.P$3 90.29,6.62 R19.P$1 90.81,6.61 91.19,6.98 91.54,6.98 93,8.44 v93.22,8.44
  Bottom 0.508: J2.P$3 v148.34,7.11
VPROTECTED  (via drill 0.3, 0.35)
  Top 0.254: LED2.VDD 144.17,7.37 144.13,7.34 v143.96,7.34 143.94,7.36 C7.P$1
  Top 0.305: 28.68,5.36 28.78,5.46
  Top 0.508: 28.78,5.46 v29.21,5.46 | 28.68,5.36 28.68,5.34 JP1.1
  Route2 0.61: v29.21,5.46 29.44,5.46 29.74,5.77 33.7,5.77 34.88,6.94 v35.56,6.94
  Route63 0.508: v83.11,6.45 83.2,6.54 | 83.2,6.54 83.09,6.65 v69.72,6.65 v63.25,6.65 60.02,6.65 59.31,7.37 59.18,7.49 36.11,7.49 v35.56,6.94 | 90.3,7.16 89.23,6.09 83.65,6.09 83.2,6.54
  Route63 0.61: 136.91,6.22 138.81,8.13 141.99,8.13 142.62,7.49 143,7.11 143.38,7.11 143.74,7.11 v143.96,7.34 | 90.3,7.16 92.38,7.16 92.6,6.94 116.63,6.94 117.81,5.77 126.81,5.77 127.72,6.67 132.22,6.67 132.62,7.08 133.31,7.08 134.17,6.22 136.91,6.22 | v136.91,5.95 136.91,6.22
  Bottom 0.254: v69.72,6.65 69.42,6.35 68.44,6.35 | R15.P$2 82.93,5.97 83.11,6.15 v83.11,6.45 | C2.P$1 33.92,8.13 U2.P$3 35.25,8.13 35.56,7.82 v35.56,6.94 | LED1.VDD 144.39,8.12 144.09,7.82 144.09,7.66 143.96,7.52 v143.96,7.34 142.66,7.34 C8.P$1
  Bottom 0.305: U3.P$4 68.44,6.35 | 63.97,6.48 R2.P$2 63.29,6.6 v63.25,6.65 | U5.6 32.24,8.74 32.39,8.89 32.64,8.89 | 32.64,8.89 33.16,8.89 C2.P$1 | U5.4 32.37,9.54 32.51,9.4 32.64,9.27 32.64,8.89
  Bottom 0.61: R1.P$1 137.18,6.22 v136.91,5.95
(copper drawn outside any net)
  shapes: Route2 area x1, Route63 area x1

### Text on the board
SilkscreenTop: EN / IO0 / RX / TX | IR / EFFECT | VBAT / 3V3 / GND / GND
SilkscreenBottom: Interactive Wand IMU/LED Board | GND / RETURN | Rev 1.1 2026 | 600-0049-01.1